# Altium schematic sheet CAR.SchDoc
size A4
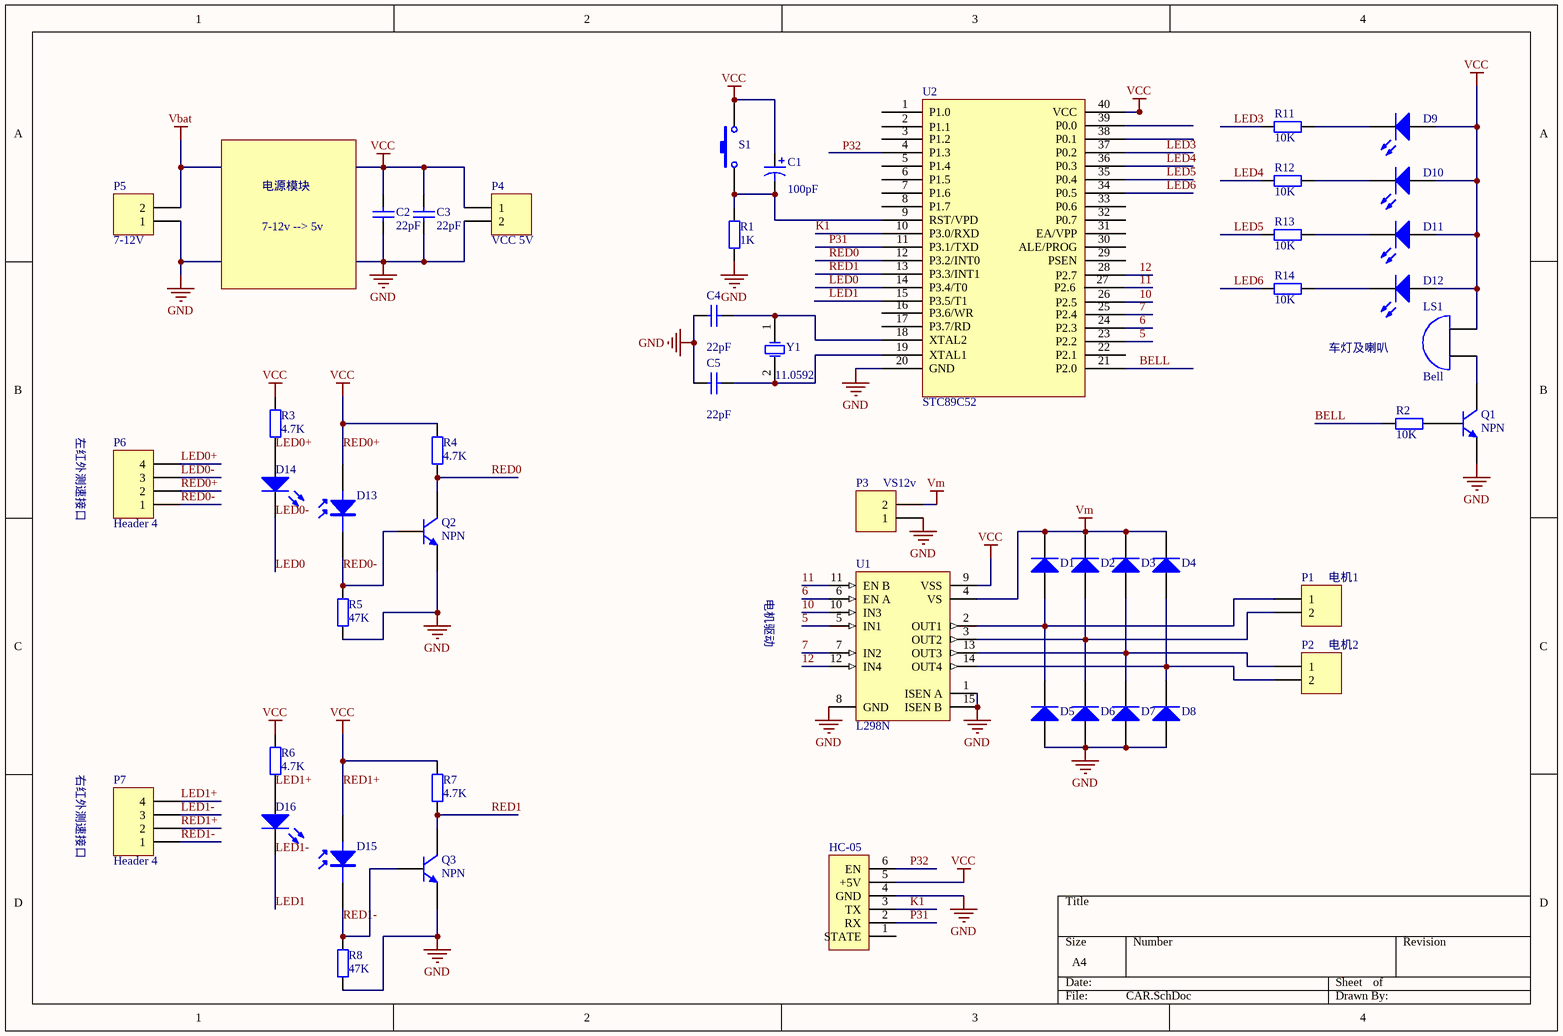
[diagram p0: CAR.SchDoc]

## Parts
C1  value 100pF  [CAPPR1.5-4x5]  (hidden comment: Cap Pol1)
C2  value 22pF  [CAPR2.54-5.1x3.2]  (hidden comment: Cap)
C3  value 22pF  [CAPR2.54-5.1x3.2]  (hidden comment: Cap)
C4  value 22pF  [CAPR2.54-5.1x3.2]  (hidden comment: Cap)
C5  value 22pF  [CAPR2.54-5.1x3.2]  (hidden comment: Cap)
D1  Diode 1N914  [DIO7.1-3.9x1.9]  (value not drawn)
D2  Diode 1N914  [DIO7.1-3.9x1.9]  (value not drawn)
D3  Diode 1N914  [DIO7.1-3.9x1.9]  (value not drawn)
D4  Diode 1N914  [DIO7.1-3.9x1.9]  (value not drawn)
D5  Diode 1N914  [DIO7.1-3.9x1.9]  (value not drawn)
D6  Diode 1N914  [DIO7.1-3.9x1.9]  (value not drawn)
D7  Diode 1N914  [DIO7.1-3.9x1.9]  (value not drawn)
D8  Diode 1N914  [DIO7.1-3.9x1.9]  (value not drawn)
D9  (no value)  [DIO7.1-3.9x1.9]
D10  (no value)  [DIO7.1-3.9x1.9]
D11  (no value)  [DIO7.1-3.9x1.9]
D12  (no value)  [DIO7.1-3.9x1.9]
D13  RED  [LED-1]  (value not drawn)
D14  (no value)  [LED-1]
D15  RED  [LED-1]  (value not drawn)
D16  (no value)  [LED-1]
HC-05  Header 6  [HDR1X6]  (value not drawn)
LS1  Bell  [PIN2]
P1  电机1  [HDR1X2]
P2  电机2  [HDR1X2]
P3  VS12v  [HDR1X2]
P4  VCC 5V  [HDR1X2]
P5  7-12V  [HDR1X2]
P6  Header 4  [HDR1X4]
P7  Header 4  [HDR1X4]
Q1  NPN  [BCY-W3]
Q2  NPN  [BCY-W3]
Q3  NPN  [BCY-W3]
R1  value 1K  [AXIAL-0.4]  (hidden comment: Res2)
R2  10K  [AXIAL-0.4]
R3  4.7K  [AXIAL-0.4]
R4  4.7K  [AXIAL-0.4]
R5  47K  [AXIAL-0.4]
R6  4.7K  [AXIAL-0.4]
R7  4.7K  [AXIAL-0.4]
R8  47K  [AXIAL-0.4]
R11  10K  [AXIAL-0.4]
R12  10K  [AXIAL-0.4]
R13  10K  [AXIAL-0.4]
R14  10K  [AXIAL-0.4]
S1  SW-PB  [SPST-2]  (value not drawn)
U1  L298N  [Multiwatt15V]
U2  STC89C52  [DIP-40]
Y1  Publisher: 11.0592  [BCY-W2/D3.1]  (hidden comment: XTAL)

## Nets
GND: C2.1 C3.1 C4.1 C5.1 D5.1(A) D6.1(A) D7.1(A) D8.1(A) HC-05.4(GND) P3.1 P4.2 P5.1 Q1.3(E) Q2.3(E) Q3.3(E) R1.1 R5.1 R8.1 U1.1(ISEN_A) U1.8(GND) U1.15(ISEN_B) U2.20(GND)
RED0+: C1.1 C2.2 C3.2 D9.1(A) D10.1(A) D11.1(A) D12.1(A) D13.A D15.A HC-05.5(+5V) LS1.2(B) P4.1 P6.2 P7.2 R3.2 R4.2 R6.2 R7.2 S1.2 U1.9(VSS) U2.40(VCC)  [also labelled RED1+, VCC]
Vbat: P5.2
Vm: D1.2(K) D2.2(K) D3.2(K) D4.2(K) P3.2 U1.4(VS)
5: U1.5(IN1) U2.23(P2.2)
6: U1.6(EN_A) U2.24(P2.3)
7: U1.7(IN2) U2.25(P2.4)
10: U1.10(IN3) U2.26(P2.5)
11: U1.11(EN_B) U2.27(P2.6)
12: U1.12(IN4) U2.28(P2.7)
BELL: R2.2 U2.21(P2.0)
K1: HC-05.3(TX) U2.10(P3.0/RXD)
LED0: D14.2(K) P6.3 U2.14(P3.4/T0)  [also labelled LED0-]
LED0+: D14.1(A) P6.4 R3.1
LED1: D16.2(K) P7.3 U2.15(P3.5/T1)  [also labelled LED1-]
LED1+: D16.1(A) P7.4 R6.1
LED3: R11.2 U2.37(P0.2)
LED4: R12.2 U2.36(P0.3)
LED5: R13.2 U2.35(P0.4)
LED6: R14.2 U2.34(P0.5)
P31: HC-05.2(RX) U2.11(P3.1/TXD)
P32: HC-05.6(EN)
RED0: Q2.1(C) R4.1 U2.12(P3.2/INT0)
RED0-: D13.K P6.1 Q2.2(B) R5.2
RED1: Q3.1(C) R7.1 U2.13(P3.3/INT1)
RED1-: D15.K P7.1 Q3.2(B) R8.2
NetC1_2: C1.2 R1.2 S1.1 U2.9(RST/VPD)
NetC4_2: C4.2 U2.18(XTAL2) Y1.1(OSC1)
NetC5_2: C5.2 U2.19(XTAL1) Y1.2(OSC2)
NetD1_1: D1.1(A) D5.2(K) P1.1 U1.2(OUT1)
NetD2_1: D2.1(A) D6.2(K) P1.2 U1.3(OUT2)
NetD3_1: D3.1(A) D7.2(K) P2.1 U1.13(OUT3)
NetD4_1: D4.1(A) D8.2(K) P2.2 U1.14(OUT4)
NetD9_2: D9.2(K) R11.1
NetD10_2: D10.2(K) R12.1
NetD11_2: D11.2(K) R13.1
NetD12_2: D12.2(K) R14.1
NetLS1_1: LS1.1(A) Q1.1(C)
NetQ1_2: Q1.2(B) R2.1

Not connected (* = marked no-connect by the designer): HC-05 1(STATE); U2 1(P1.0) 2(P1.1) 3(P1.2) 4(P1.3) 5(P1.4) 6(P1.5) 7(P1.6) 8(P1.7) 16(P3.6/WR) 17(P3.7/RD) 22(P2.1) 29(PSEN) 30(ALE/PROG) 31(EA/VPP) 32(P0.7) 33(P0.6) 38(P0.1) 39(P0.0)

## Notes on the sheet
- 电源模块
- (near C2) 7-12v --> 5v
- 车灯及喇叭
- 左红外测速接口
- 电机驱动
- 右红外测速接口
- Labels drawn without touching a wire or pin: P32

## Library data of the parts
C1 = Cap Pol1: Polarized Capacitor (Radial); Published: 8-Jun-2000; LatestRevisionDate: 17-Jul-2002; LatestRevisionNote: Re-released for DXP Platform.; PackageReference: RB7.6-15; Publisher: Altium Limited
C2-C5 = Cap: Capacitor; Published: 8-Jun-2000; LatestRevisionDate: 17-Jul-2002; LatestRevisionNote: Re-released for DXP Platform.; PackageReference: RAD-0.3; Publisher: Altium Limited
D1-D8 = Diode 1N914: High Conductance Fast Diode; Published: 8-Jun-2000; LatestRevisionDate: 17-Jul-2002; LatestRevisionNote: Re-released for DXP Platform.; DatasheetVersion: 1997; PackageReference: DO-35; Publisher: Altium Limited; Code_JEDEC: DO-204-AH; ComponentLink1Description: Manufacturer Link; ComponentLink1URL: http://www.fairchildsemi.com/; ComponentLink2Description: Datasheet; ComponentLink2URL: http://www.fairchildsemi.com/ds/1N%2F1N4448.pdf
D9-D12 D14 D16 = LED0: Typical INFRARED GaAs LED; Published: 8-Jun-2000; LatestRevisionDate: 08-Jul-2005; LatestRevisionNote: Mech Layer 1 removed.; PackageReference: LED-0; Publisher: Altium Limited
D13 D15 = LED_RCV: pin to pad: A>1 K>2
HC-05 = Header 6: Header, 6-Pin; LatestRevisionDate: 17-Jul-2002; LatestRevisionNote: Re-released for DXP Platform.; Publisher: Altium Limited
LS1 = Bell: Electrical Bell; Published: 24-Mar-1999; LatestRevisionDate: 17-Jul-2002; LatestRevisionNote: Re-released for DXP Platform.; PackageReference: PIN2; Publisher: Altium Limited
P1-P5 = Header 2: Header, 2-Pin; LatestRevisionDate: 17-Jul-2002; LatestRevisionNote: Re-released for DXP Platform.; Publisher: Altium Limited
P6 P7 = Header 4: Header, 4-Pin; LatestRevisionDate: 17-Jul-2002; LatestRevisionNote: Re-released for DXP Platform.; Publisher: Altium Limited
Q1-Q3 = NPN: NPN Bipolar Transistor; Published: 8-Jun-2000; LatestRevisionDate: 17-Jul-2002; LatestRevisionNote: Re-released for DXP Platform.; PackageReference: TO-226; Publisher: Altium Limited; Code_JEDEC: TO-226-AA
R1 = Res2: Resistor; Published: 8-Jun-2000; LatestRevisionDate: 17-Jul-2002; LatestRevisionNote: Re-released for DXP Platform.; PackageReference: AXIAL-0.4; Publisher: Altium Limited
R2-R8 R11-R14 = Res2: Resistor; Value: 1K; Published: 8-Jun-2000; LatestRevisionDate: 17-Jul-2002; LatestRevisionNote: Re-released for DXP Platform.; PackageReference: AXIAL-0.4; Publisher: Altium Limited
S1 = SW-PB: Switch; Published: 24-Mar-1999; LatestRevisionDate: 17-Jul-2002; LatestRevisionNote: Re-released for DXP Platform.; PackageReference: SPST-2; Publisher: Altium Limited
U1 = L298N: Dual Full Bridge Driver; Published: 8-Jun-2000; LatestRevisionDate: 14-May-2007; LatestRevisionNote: Mapped to vertical PCB.; DatasheetVersion: Jul-1999; PackageReference: Multiwatt15V; Publisher: Altium Limited; PackageDescription: TO, Thru-Hole, Vertical, Heatsink Mounted; 15 Bent Staggered Leads; Pitch 1.27 mm; ComponentLink1Description: Manufacturer Link; ComponentLink1URL: http://www.st.com/; ComponentLink2Description: Datasheet; ComponentLink2URL: http://www.st.com/stonline/products/literature/ds/1773/l298.pdf
Y1 = XTAL: Crystal Oscillator; Published: 8-Jun-2000; LatestRevisionDate: 17-Jul-2002; LatestRevisionNote: Re-released for DXP Platform.; PackageReference: R38